# EAGLE design Adafruit 2.9in eInk Display (EAGLE 9.5.0)
COMPANY: ADAFRUIT INDUSTRIES; DRAWN: K. TOWNSEND; REV: A
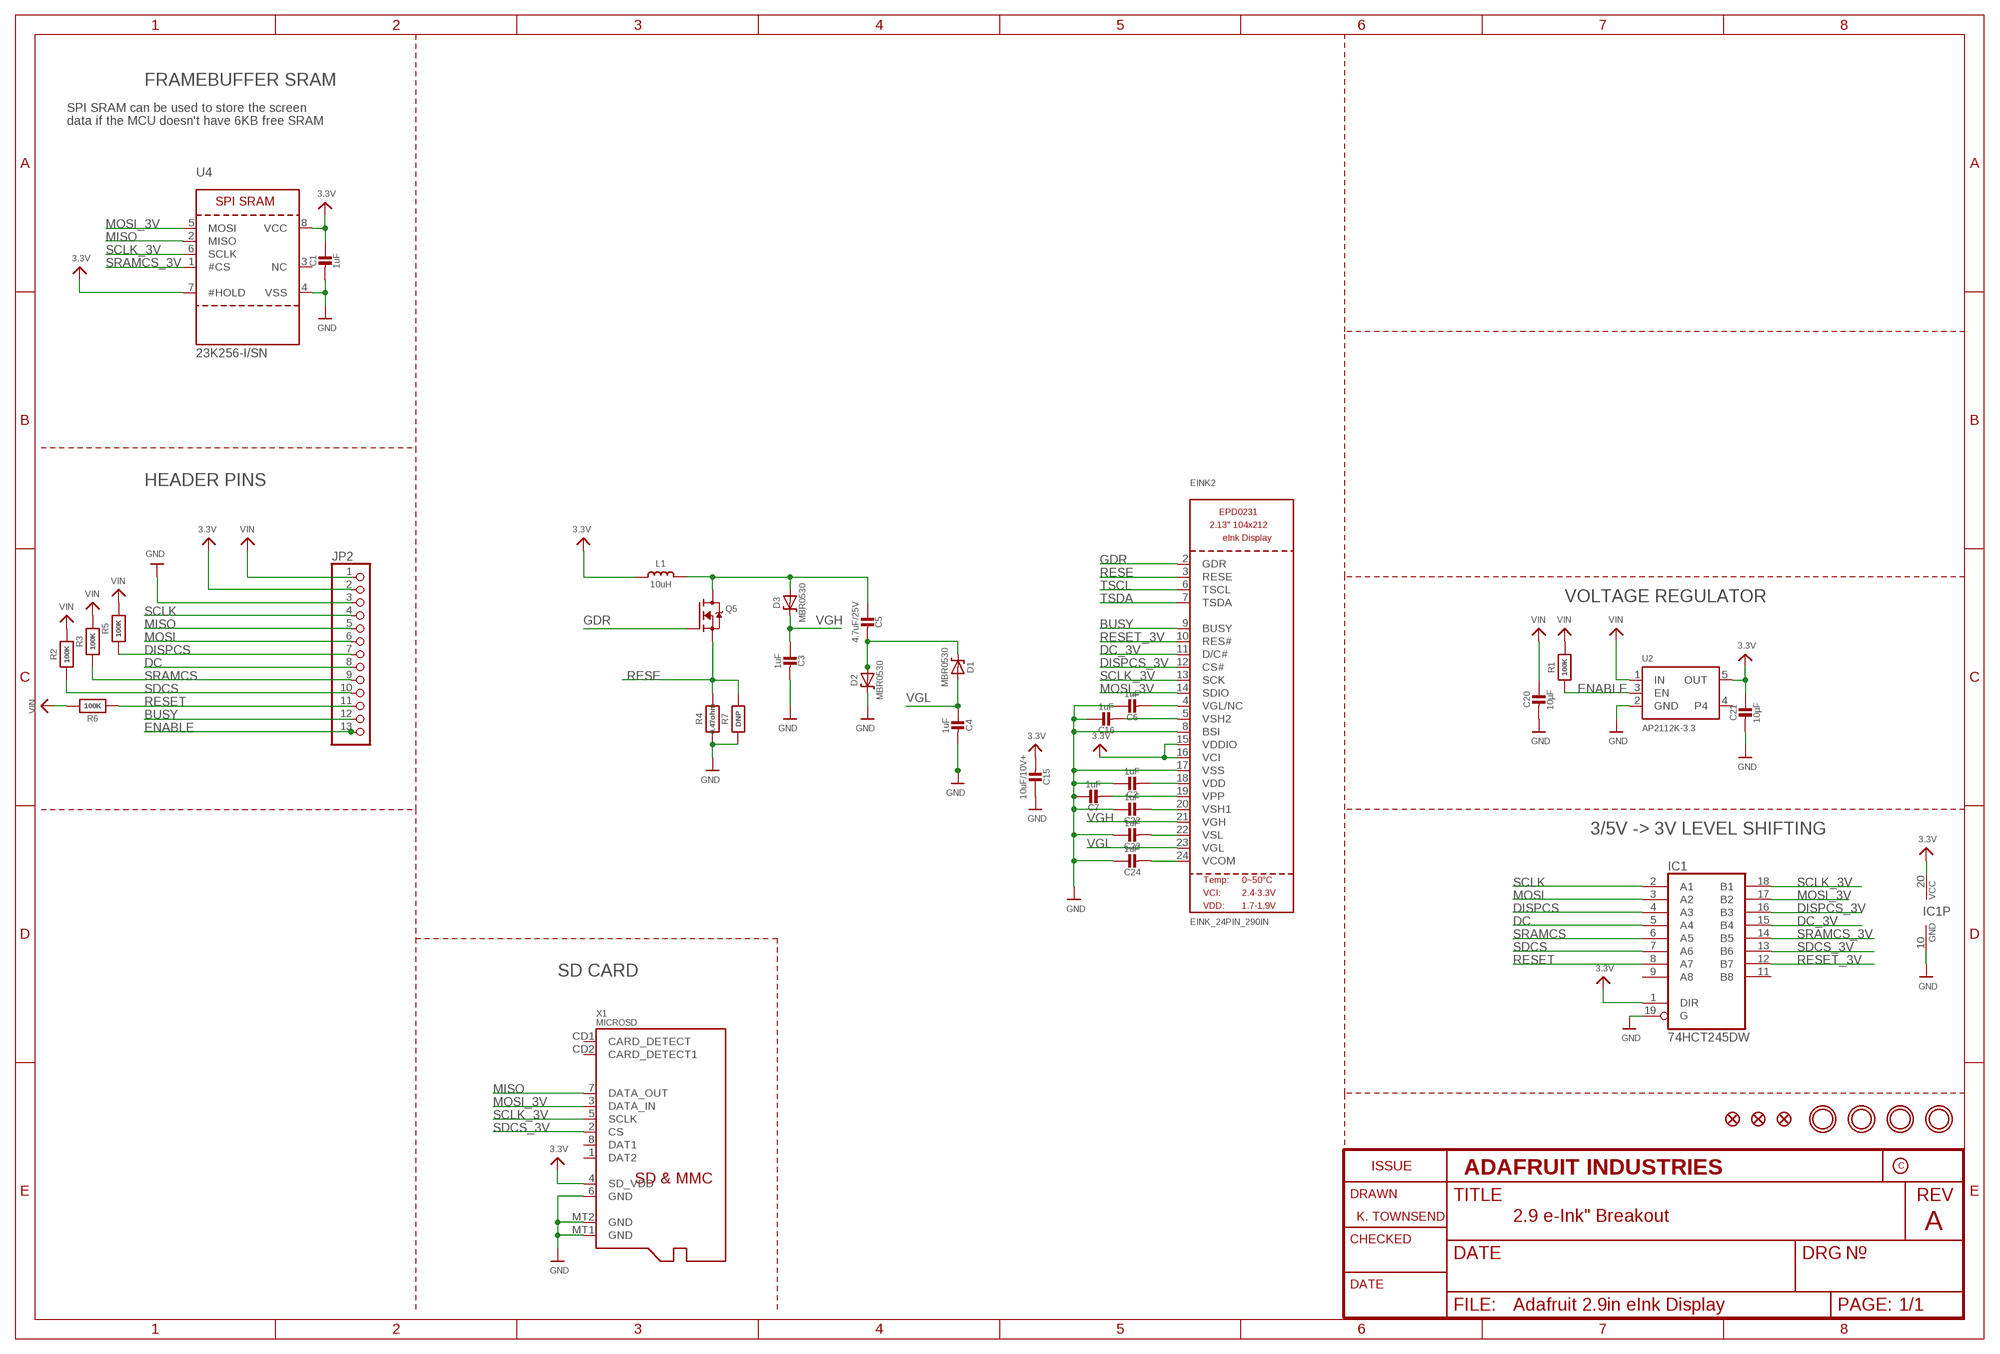
[diagram p0: schematic, sheet 1]

## Parts
C1  1uF  CAP_CERAMIC0805_10MGAP  [0805_10MGAP]
C2  1uF  CAP_CERAMIC0805-NOOUTLINE  [0805-NO]
C3  1uF  CAP_CERAMIC0805-NOOUTLINE  [0805-NO]
C4  1uF  CAP_CERAMIC0805-NOOUTLINE  [0805-NO]
C5  4.7uF/25V  CAP_CERAMIC0805-NOOUTLINE  [0805-NO]
C6  1uF  CAP_CERAMIC0805-NOOUTLINE  [0805-NO]
C7  1uF  CAP_CERAMIC0805-NOOUTLINE  [0805-NO]
C15  10uF/10V+  CAP_CERAMIC0805-NOOUTLINE  [0805-NO]
C16  1uF  CAP_CERAMIC0805-NOOUTLINE  [0805-NO]
C20  10µF  CAP_CERAMIC0805-NOOUTLINE  [0805-NO]
C21  10µF  CAP_CERAMIC0805-NOOUTLINE  [0805-NO]
C22  1uF  CAP_CERAMIC0805-NOOUTLINE  [0805-NO]
C23  1uF  CAP_CERAMIC0805-NOOUTLINE  [0805-NO]
C24  1uF  CAP_CERAMIC0805-NOOUTLINE  [0805-NO]
D1  MBR0530  DIODE-SCHOTTKYSOD-123  [SOD-123]
D2  MBR0530  DIODE-SCHOTTKYSOD-123  [SOD-123]
D3  MBR0530  DIODE-SCHOTTKYSOD-123  [SOD-123]
EINK2  EINK_24PIN_290IN  [EINK_290IN]
FID1  FIDUCIAL_1MM  [FIDUCIAL_1MM]
FID2  FIDUCIAL_1MM  [FIDUCIAL_1MM]
FID3  FIDUCIAL_1MM  [FIDUCIAL_1MM]
IC1  74HCT245DW  [SO20W]
JP2  HEADER-1X13  [1X13_ROUND_70]
L1  10uH  INDUCTORNR401  [INDUCTOR_4X4MM_NR401]
Q5  IRLML0100  IRLML2060TRPBF  [SOT23-3]
R1  100K  RESISTOR0805_NOOUTLINE  [0805-NO]
R2  100K  RESISTOR0805_NOOUTLINE  [0805-NO]
R3  100K  RESISTOR0805_NOOUTLINE  [0805-NO]
R4  0.47ohm  RESISTOR0805_10MGAP  [0805_10MGAP]
R5  100K  RESISTOR0805_NOOUTLINE  [0805-NO]
R6  100K  RESISTOR0805_NOOUTLINE  [0805-NO]
R7  DNP  RESISTOR0805_10MGAP  [0805_10MGAP]
U2  AP2112K-3.3  VREG_SOT23-5  [SOT23-5]
U4  23K256-I/SN  SRAM_SPI_SOIC8  [SOIC8_150MIL]
U$3  MOUNTINGHOLE2.5  [MOUNTINGHOLE_2.5_PLATED]
U$4  MOUNTINGHOLE2.5  [MOUNTINGHOLE_2.5_PLATED]
U$5  MOUNTINGHOLE2.5  [MOUNTINGHOLE_2.5_PLATED]
U$6  MOUNTINGHOLE2.5  [MOUNTINGHOLE_2.5_PLATED]
X1  MICROSD  [MICROSD]

## Nets
3.3V: C1.1 C15.2 C21.1 EINK2.15(VDDIO) EINK2.16(VCI) IC1.1(DIR) IC1.20(VCC) JP2.2 L1.P$2 U2.5(OUT) U4.7(#HOLD) U4.8(VCC) X1.4(SD_VDD)
BUSY: EINK2.9(BUSY) JP2.12
DC: IC1.5(A4) JP2.8
DC_3V: EINK2.11(D/C#) IC1.15(B4)
DISPCS: IC1.4(A3) JP2.7 R5.1
DISPCS_3V: EINK2.12(CS#) IC1.16(B3)
ENABLE: JP2.13 R1.1 U2.3(EN)
GDR: EINK2.2(GDR) Q5.1(G)
GND: C1.2 C2.1 C3.2 C4.2 C6.1 C7.1 C15.1 C16.1 C20.2 C21.2 C22.1 C23.1 C24.1 D2.C EINK2.8(BSI) EINK2.17(VSS) IC1.10(GND) IC1.19(G) JP2.3 R4.2 R7.2 U2.2(GND) U4.4(VSS) X1.6(GND) X1.MT1(GND) X1.MT2(GND)
MISO: JP2.5 U4.2(MISO) X1.7(DATA_OUT)
MOSI: IC1.3(A2) JP2.6
MOSI_3V: EINK2.14(SDIO) IC1.17(B2) U4.5(MOSI) X1.3(DATA_IN)
N$1: C7.2 EINK2.19(VPP)
N$2: C5.2 D1.C D2.A
N$3: C5.1 D3.A L1.P$1 Q5.3(D)
N$4: C16.2 EINK2.5(VSH2)
N$5: C2.2 EINK2.18(VDD)
N$6: C22.2 EINK2.20(VSH1)
N$9: C6.2 EINK2.4(VGL/NC)
N$27: C23.2 EINK2.22(VSL)
N$33: C24.2 EINK2.24(VCOM)
RESE: EINK2.3(RESE) Q5.2(S) R4.1 R7.1
RESET: IC1.8(A7) JP2.11 R6.1
RESET_3V: EINK2.10(RES#) IC1.12(B7)
SCLK: IC1.2(A1) JP2.4
SCLK_3V: EINK2.13(SCK) IC1.18(B1) U4.6(SCLK) X1.5(SCLK)
SDCS: IC1.7(A6) JP2.10 R2.1
SDCS_3V: IC1.13(B6) X1.2(CS)
SRAMCS: IC1.6(A5) JP2.9 R3.1
SRAMCS_3V: IC1.14(B5) U4.1(#CS)
TSCL: EINK2.6(TSCL)
TSDA: EINK2.7(TSDA)
VGH: C3.1 D3.C EINK2.21(VGH)
VGL: C4.1 D1.A EINK2.23(VGL)
VIN: C20.1 JP2.1 R1.2 R2.2 R3.2 R5.2 R6.2 U2.1(IN)
Unconnected: IC1.9(A8) IC1.11(B8) U2.4 U4.3(NC) X1.1(DAT2) X1.8(DAT1) X1.CD1(CARD_DETECT) X1.CD2(CARD_DETECT1)

## Notes on the sheet
- FRAMEBUFFER SRAM
- SPI SRAM can be used to store the screen
- data if the MCU doesn't have 6KB free SRAM
- HEADER PINS
- VOLTAGE REGULATOR
- 3/5V -> 3V LEVEL SHIFTING
- SD CARD
- 2.9 e-Ink" Breakout

## Library data of the parts
C1-C7 C15 C16 C20-C24 = microbuilder:CAP_CERAMIC: Ceramic Capacitors For new designs, use the packages preceded by an '_' character since they are more reliable: The following footprints should be used on most boards: _0402 - Standard footprint for regular board layouts _0603 - Standard footprint for regular board layouts _0805 - Standard footprint for regular board layouts _1206 - Standard footprint for regular board layouts For extremely tight-pitch boards where space is at a premium, the following 'micro-pitch' footprints can be used (smaller pads, no silkscreen outline, etc.): _0402MP - Micro-pitch footprint for very dense/compact boards _0603MP - Micro-pitch footprint for very dense/compact boards _0805MP - Micro-pitch footprint for very dense/compact boards _1206MP - Micro-pitch footprint for very dense/compact boards
D1-D3 = microbuilder:DIODE-SCHOTTKY
EINK2 = microbuilder:EINK_24PIN
FID1-FID3 = microbuilder:FIDUCIAL: Fiducial Alignment Points Various fiducial points for machine vision alignment.; BOM: EXCLUDE
IC1 = 74xx-eu:74*245: Octal BUS TRANSCEIVER, 3-state
JP2 = microbuilder:HEADER-1X13
L1 = microbuilder:INDUCTOR: Inductors 0603: 10nH Ceramic Inductor - microwire antenna/RF (Digikey: 712-1434-2-ND) 0805: 560nH Ceramic Inductor - RF (Digikey: 553-1047-1-ND) 270nH Ceramic Inductor - Q = 40@250MHz, +-5%, 1 Ohm DC Resistance (Digikey: 535-10506-2-ND) 1007 (2518 Metric) SMT: 10µH 10% 250mOhm 820mA 1007 Inductor (Digikey: 587-2189-1-ND) 22µH 10% 500mOhm 580mA 1007 Inductor (Digikey: 587-2190-1-ND) 47µH 10% 950mOhm 420mA 1007 Inductor (Digikey: 587-2191-1-ND) 47µH 5% 100mOhm 1A 1008 Inductor (Digikey: 732-1816-1-ND) 5.0x5.0mm (Taiyo Yuden NR5040 Series) 6.8µH 20% 2.3A 64mOhm Inductor (Digikey: 587-2374-2-ND) 5.0x5.0mm (TDK VLC5045 Series) 4.7µH 20% 3.3A 34mOhm Inductor (Digikey: 445-6526-1-ND) 6.8µH 20% 2.7A 46mOhm Inductor (Digikey: 445-6527-1-ND) 6.0x6.0mm (TDK VLC6045 Series) 4.7µH 20% 3.8A 27mOhm Inductor (Digikey: 445-6538-2-ND) 6.8µH 20% 3A 41mOhm Inductor (Digikey: 445-6540-1-ND) 6.2µH 30% 2.2A 45mOhm Inductor (Digikey: SRR5028-6R2YCT-ND) - Not TDK VLC6045 but footprint should match 6.0x6.0mm (TDK SLF6045 Series) 6.8uH 30% 2A 33mOhm Inductor (Digikey: 445-4572-1-ND, Mouser: 810-SLF645T6R8N2R0PF) 6.0x6.0mm (Sumida CDRH5D28 Series) 6.2uH 30% 1.8A 45mOhm Inductor (Digikey: 308-1542-1-ND) Taiyo Yuden NR3015T2R2M - 2.2uH 20% 1.5A (Digikey: 587-1648-2-ND, Mouser: 963-NR3015T2R2M) - Used with TI TPS62172 CoilCraft RFID Transponder Coil - MA5532-AE (For use with AS3935 Lightning Sensor) Taiyo Yuden NRH2412T2R2MNGH - 2.2uH 20% 1AA (Digikey: 587-3443-1-ND) - Used with TI LM3671 Vishay IHLP 1.0uH Molded Inductor - 24mOhm DCR, 5A, +/-20%, -55°C-125°C (Digikey: 541-1319-1-ND)
Q5 = Parts:IRLML2060TRPBF
R1-R7 = microbuilder:RESISTOR: Resistors For new designs, use the packages preceded by an '_' character since they are more reliable: The following footprints should be used on most boards: _0402 - Standard footprint for regular board layouts _0603 - Standard footprint for regular board layouts _0805 - Standard footprint for regular board layouts _1206 - Standard footprint for regular board layouts For extremely tight-pitch boards where space is at a premium, the following 'micro-pitch' footprints can be used (smaller pads, no silkscreen outline, etc.): _0402MP - Micro-pitch footprint for very dense/compact boards _0603MP - Micro-pitch footprint for very dense/compact boards _0805MP - Micro-pitch footprint for very dense/compact boards _1206MP - Micro-pitch footprint for very dense/compact boards
U2 = microbuilder:VREG_SOT23-5: SOT23-5 Fixed Voltage Regulators Part Current Out V Out V In V Dropout θJA (°C/W) TJ (°C) Digikey Part No. ADP121 150mA 3.3V 3.4-5.5V 0.09V @ 150mA -- -- ADP121-AUJZ33R7CT-ND ADP121 150mA 3.0V 3.1-5.5V 0.09V @ 150mA -- -- ADP121-AUJZ30R7CT-ND ADP122 300mA 3.3V 3.4-5.5V 0.085V @ 300mA -- -- ADP122AUJZ-3.3-R7CT-ND ADP1712 300mA 3.3V 3.5-5.5V 0.17V @ 300mA -- -- ADP1712AUJZ-3.3-R7TR-ND AP7311 (Low Cost) 150mA 3.3V 3.5-6V 0.15V @ 150mA -- -- AP7311-33WG-7DICT-ND LD39015M18R 150mA 1.8V 1.9V-5.5V 0.08V @ 100mA -- -- 497-6977-1-ND LP2985A-33DBVR 150mA 3.3V 3.3-16V 0.28V @ 150mA 206 150 296-18479-1-ND MCP1824T-3302E/OT 300mA 3.3V 3.5V-6V 0.2V @ 300mA -- -- MCP1824T-3302E/OTCT-ND MIC5205-2.5YM5 TR 150mA 2.5V 2.7-16V 0.165V @ 150mA -- -- 576-1257-2-ND MIC5205-3.0YM5 TR 150mA 3.0V 3.2V-16V 0.165V @ 150mA -- -- 576-1258-2-ND MIC5205-3.3YM5 TR 150mA 3.3V 3.5V-16V 0.165V @ 150mA -- -- 576-1259-2-ND TPS780330220 150mA 3.3V+2.2V 3.6-5.5V 250mV Max -- -- 296-23332-1-ND TDA3663/N1,135 100mA 3.3V 3.5-45V 0.18V @ 50mA -- -- 568-5343-1-ND Max operating temp can be calculated using θJA, TJ (max junction temperature), and power in watts. Set the "Maximum Ambient Temperature" until it reaches TJ ("Max Junction Temperature"), which is the absolute limit for safe use of the regulator: Heat Sink Temperature Calculator <http://www.daycounter.com/Calculators/Heat-Sink-Temperature-Calculator.phtml> For example, With 12V source into a 3.3V LP2985 and a 30mA load, we are dissipating (12V-3.3V) * 0.03A = 0.261W. With a θJA of 206 °C/W, a TJ of 150°C, and 261mW we can safely use the chip without a heat sink up to 75°C (=147.1°C Junction Temperature).
U4 = microbuilder:SRAM_SPI_SOIC8: SRAM - 8-Pin SPI Interface 23K640-I/SN - 8KB (64Kb), 20MHz, 2.7-3.6V 23K256-I/SN - 32KB (256Kb), 20MHz, 2.7-3.6V 23LC512-I/SN - 64KB (512Kb), 20MHz, 2.7-3.6V
U$3-U$6 = microbuilder:MOUNTINGHOLE: Mounting Hole For #2 screws (0.086"/2.18mm width, 0.094"/2.4mm hole) use 2.5mm; BOM: EXCLUDE
X1 = microbuilder:MICROSD: MicroSD/Transflash Card Holder with SPI pinout 3M: 2908-05WB-MG 4UConnector: 19656 Footprint courtesy: Adafruit Industries

## Board
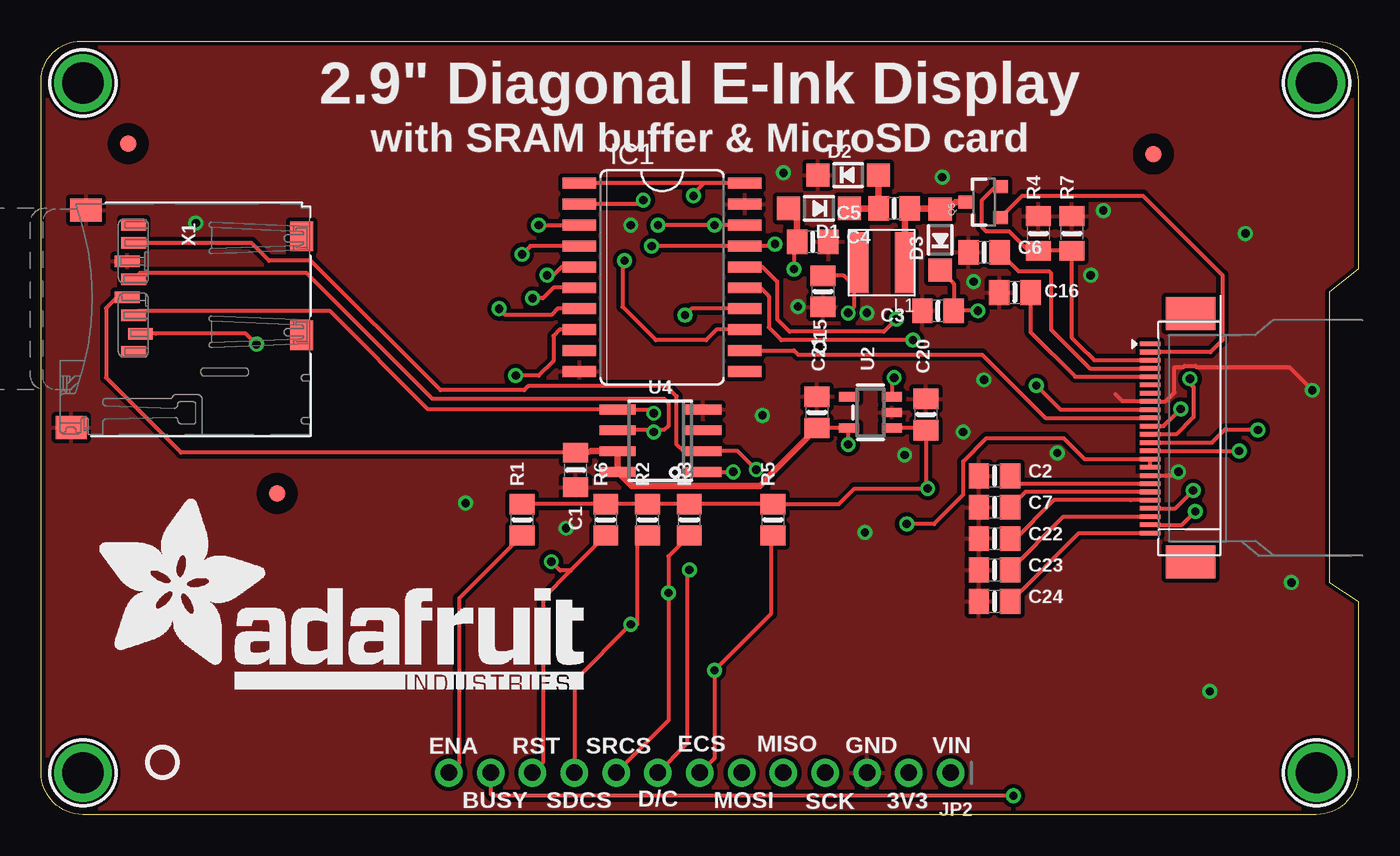
[diagram p1: board, top side]
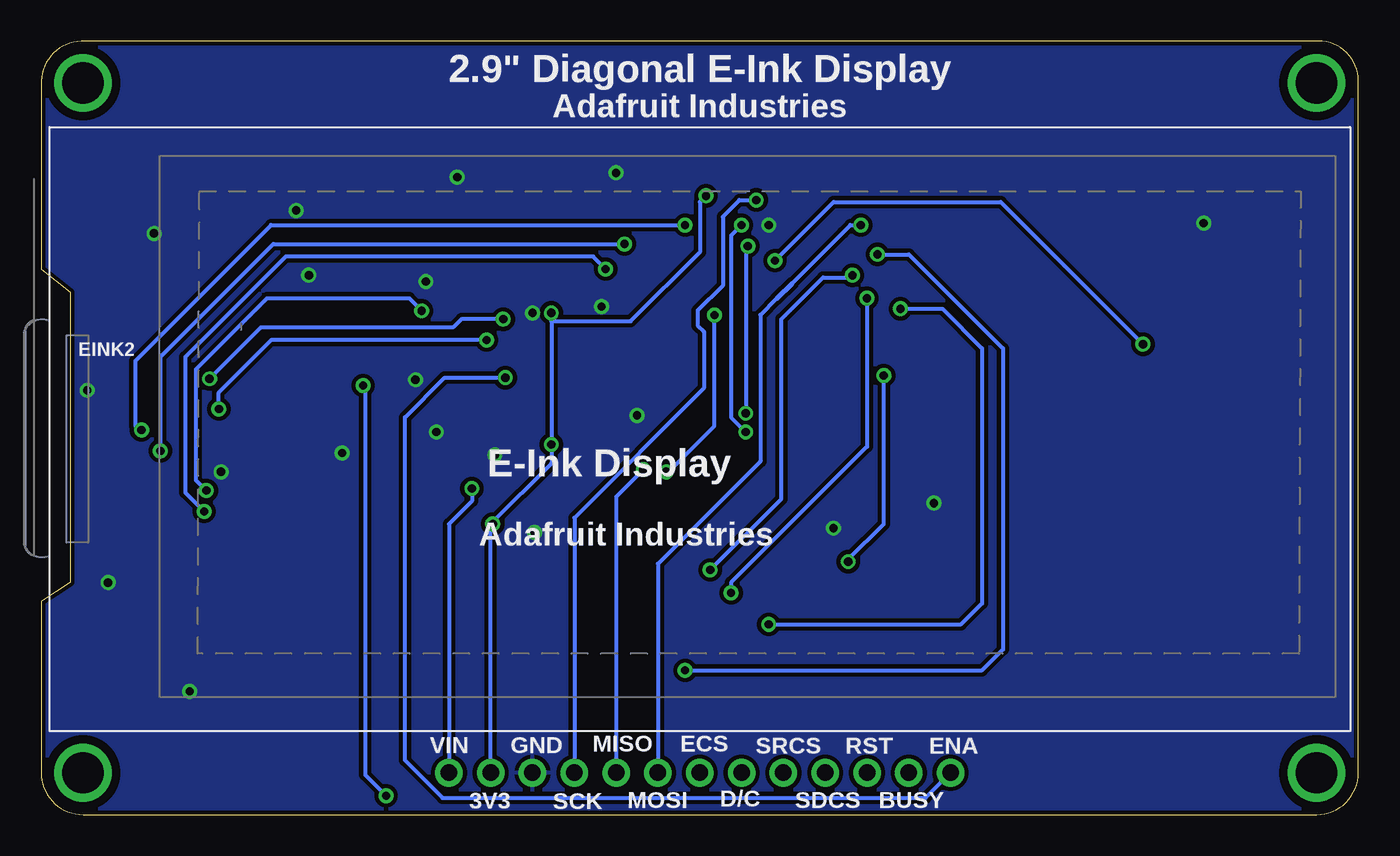
[diagram p2: board, bottom side, seen from below]

Size 80.01 x 46.99 mm. Coordinates in mm from the lower left corner, seen from the top.
Outline: 2.41,46.99 77.34,46.99 arc-90 80.01,44.58 80.01,33.15 78.23,31.75 78.23,14.1 80.01,12.95 80.01,2.54 arc-90 77.47,0 2.53,0 arc-90 0,2.53 0,44.58 arc-90 2.41,46.99
Copper layers (1*16): Top 0.035mm / dielectric 1.5mm / Bottom 0.035mm
Design rules "adafruit *": minimum track width 8mil, minimum drill 15.5mil, track to track 8mil, track to pad 8mil, pad to pad 8mil, via to via 8mil, smd to smd 8mil, copper to edge 10mil, drill to drill 8mil, minimum pad ring 10mil, minimum via ring 8mil, stop-mask expansion 2mil, vias tented up to drill 20mil, thermal gap 10mil

### Footprints (pad centres in the part's own frame; a part is rotated, then mirrored left to right if it is on the bottom)
0805_10MGAP = smd 1.2 x 1.5: 1 -1.05,0; 2 1.05,0
0805-NO = smd 1.24 x 1.5: 1 -0.95,0; 2 0.95,0
SOD-123 = smd 1.4 x 1.4: A 1.85,0; C -1.85,0
EINK_290IN = smd 1.25 x 0.275 bottom: 1 2.51,5.208; 2 2.51,4.708; 3 2.51,4.208; 4 2.51,3.708; 5 2.51,3.208; 6 2.51,2.708; 7 2.51,2.208; 8 2.51,1.708; 9 2.51,1.208; 10 2.51,0.708; 11 2.51,0.208; 12 2.51,-0.292; 13 2.51,-0.792; 14 2.51,-1.292; 15 2.51,-1.792; 16 2.51,-2.292; 17 2.51,-2.792; 18 2.51,-3.292; 19 2.51,-3.792; 20 2.51,-4.292; 21 2.51,-4.792; 22 2.51,-5.292; 23 2.51,-5.792; 24 2.51,-6.292 | smd 3 x 2 bottom: SPRT1 0.05,7.058; SPRT2 0.05,-8.052
FIDUCIAL_1MM = smd 1 x 1: 1 0,0
SO20W = smd 0.66 x 2.032: 1 -5.715,-5.029; 2 -4.445,-5.029; 3 -3.175,-5.029; 4 -1.905,-5.029; 5 -0.635,-5.029; 6 0.635,-5.029; 7 1.905,-5.029; 8 3.175,-5.029; 9 4.445,-5.029; 10 5.715,-5.029; 11 5.715,5.029; 12 4.445,5.029; 13 3.175,5.029; 14 1.905,5.029; 15 0.635,5.029; 16 -0.635,5.029; 17 -1.905,5.029; 18 -3.175,5.029; 19 -4.445,5.029; 20 -5.715,5.029
1X13_ROUND_70 = drill 1 pad 1.676: 1 -15.24,0; 2 -12.7,0; 3 -10.16,0; 4 -7.62,0; 5 -5.08,0; 6 -2.54,0; 7 0,0; 8 2.54,0; 9 5.08,0; 10 7.62,0; 11 10.16,0; 12 12.7,0; 13 15.24,0
INDUCTOR_4X4MM_NR401 = smd 1.2 x 3.7: P$1 -1.4,0; P$2 1.4,0
SOT23-3 = smd 0.8 x 0.9: 1 -0.95,-1; 2 0.95,-1; 3 0,1.1
SOT23-5 = smd 0.55 x 1.2: 1 -0.95,-1.3; 2 0,-1.3; 3 0.95,-1.3; 4 0.95,1.3; 5 -0.95,1.3
SOIC8_150MIL = smd 0.6 x 2.2: 1 -1.905,-2.6; 2 -0.635,-2.6; 3 0.635,-2.6; 4 1.905,-2.6; 5 1.905,2.6; 6 0.635,2.6; 7 -0.635,2.6; 8 -1.905,2.6
MOUNTINGHOLE_2.5_PLATED = drill 2.5 pad 3.2: P$1 0,0
MICROSD = smd 0.7 x 1.5: 1 9,-10.64; 2 7.9,-10.24; 3 6.8,-10.64; 4 5.7,-11.04; 5 4.6,-10.64; 6 3.5,-11.04; 7 2.4,-10.64; 8 1.3,-10.64 | smd 1.8 x 1.4: CD1 2,-0.44; CD2 8,-0.44 | smd 1.4 x 1.9: MT1 0.4,-13.54; MT2 13.6,-14.44

### Placement (x,y rotation side)
C1  32.46,20.93 270 top
C2  57.91,20.57 0 top
C3  54.48,30.61 180 top
C4  46.86,34.8 0 top
C5  51.82,36.83 180 top
C6  57.28,34.16 0 top
C7  57.91,18.67 0 top
C15  47.49,31.79 90 top
C16  59.14,31.71 0 top
C20  53.74,24.31 90 top
C21  47.13,24.44 90 top
C22  57.91,16.76 0 top
C23  57.91,14.86 0 top
C24  57.91,12.95 0 top
D1  47.24,36.83 180 top
D2  49.02,38.86 0 top
D3  54.61,34.92 90 top
EINK2  69.88,23.39 0 bottom
FID1  5.29,40.76 0 top
FID2  14.34,19.51 90 top
FID3  67.56,40.13 0 top
IC1  37.72,32.64 270 top
JP2  40.01,2.54 180 top
L1  51.05,33.53 180 top
Q5  57.28,37.21 90 top
R1  29.21,17.91 90 top
R2  36.83,17.91 90 top
R3  39.37,17.91 90 top
R4  60.58,35.31 90 top
R5  44.45,17.91 90 top
R6  34.29,17.91 90 top
R7  62.61,35.31 90 top
U2  50.37,24.44 90 top
U4  37.61,22.71 90 top
U$3  77.47,2.54 0 top
U$4  2.54,2.54 0 top
U$5  77.47,44.45 0 top
U$6  2.54,44.45 0 top
U$9  [PCBFEAT-REV-040]  7.37,3.17 0 top
U$39  [ADAFRUIT_TEXT_30MM]  3.3,7.62 0 top
X1  16.27,37.12 270 top

### Tracks (layer width: path | path; a pad name or v marks a point on that pad's centre or on a via)
3.3V  (via drill 0.5)
  Top 0.203: C21.1 46.68,23.04
  Top 0.254: 40.26,38.35 IC1.1 | IC1.20 40.26,38.35 | C15.2 48.76,32.74 49.37,32.13 49.37,30.83 v49.02,30.48 | C21.1 U2.5 49.02,23.43 v49.02,22.48 | 40.26,38.35 39.62,37.72 v39.62,37.59 | X1.4 4.59,31.42 3.94,30.77 3.94,26.54 8.49,21.98 C1.1 33.31,21.98 33.4,22.08 | v52.58,17.65 54.23,17.65 56.01,19.44 56.01,21.46 57.42,22.87 62.1,22.87 63.37,21.6 EINK2.15 EINK2.16
  Top 0.406: L1.P$2 49.37,33.24 49.37,32.13 | 46.68,23.04 44.29,20.65 44.29,20.6 43.66,19.97 35.85,19.97 U4.8 U4.7 | U4.7 34.42,22.08 | 34.42,22.08 33.4,22.08 | U4.7 | U4.7 34.42,22.08 | 34.42,22.08
  Bottom 0.254: v49.02,30.48 49.02,29.97 | 49.02,29.97 v49.02,22.48 49.02,21.34 52.7,17.65 | v39.62,37.59 40.01,37.21 40.01,34.16 44.2,29.97 49.02,29.97 | JP2.2 52.7,17.65 | 52.7,17.65 v52.58,17.65
BUSY  (via drill 0.5)
  Top 0.254: v59.05,1.14 27.43,1.14 27.3,1.27 JP2.12 | v60.45,26.07 61.92,24.6 EINK2.9
  Bottom 0.254: v59.05,1.14 60.33,2.41 60.33,25.94 v60.45,26.07
DC  (via drill 0.5)
  Top 0.254: IC1.5 31.62,33.27 31.11,32.77 v30.73,32.77 | v39.37,14.86 39.24,14.73 39.24,4.32 JP2.8
  Bottom 0.254: v39.37,14.86 35.05,19.18 35.05,30.1 32.51,32.64 30.99,32.64 30.86,32.77 v30.73,32.77
DC_3V  (via drill 0.5)
  Top 0.203: v69.22,24.64 68.83,24.26
  Top 0.254: v52.96,28.83 44.96,28.83 44.2,29.59 44.2,31.5 43.69,32 IC1.15 | EINK2.11 68.18,23.6 68.83,24.26
  Bottom 0.254: v52.96,28.83 66.04,28.83 69.26,25.61 69.26,24.68 v69.22,24.64
DISPCS  (via drill 0.5)
  Top 0.254: IC1.4 29.72,34.54 v29.21,34.04 | R5.1 44.32,16.83 44.32,12.19 v40.89,8.76 40.89,3.43 JP2.7
  Bottom 0.254: v29.21,34.04 27.3,34.04 21.59,28.32 21.59,10.03 22.86,8.76 v40.89,8.76
DISPCS_3V  (via drill 0.5)
  Top 0.254: IC1.16 43.81,33.27 44.7,32.38 44.7,30.1 45.47,29.34 51.18,29.34 v51.94,30.1 | EINK2.12 68.95,23.1 70,24.15 70,25.98 69.79,26.19 v69.79,26.48
  Bottom 0.254: v51.94,30.1 54.48,30.1 54.99,29.59 66.67,29.59 v69.79,26.48
ENABLE  (via drill 0.5)
  Top 0.254: U2.3 51.67,26.4 v51.82,26.54 | R1.1 25.4,13.15 25.4,3.17 JP2.13
  Bottom 0.254: JP2.13 26.29,1.02 55.63,1.02 57.91,3.3 57.91,24.13 55.5,26.54 v51.82,26.54 | v51.82,26.54
GDR
  Top 0.254: Q5.1 59.61,37.59 66.93,37.59 71.75,32.77 71.75,28.83 71.03,28.1 EINK2.2
GND  (via drill 0.5)
  Top 0.254: EINK2.17 68.86,20.6 v69.09,20.83 | 65.28,25.53 65.7,25.1 EINK2.8 68.28,25.1 68.83,25.65 68.83,27.18 69.38,27.18 69.46,27.26 70.11,27.26 70.2,27.18 75.82,27.18 v77.22,25.78
  other vias: 45.09,38.99 54.74,38.73 43.81,24.26 52.45,21.84 57.28,26.42 45.97,30.86 56.64,32.38 50.04,17.14 25.78,18.92 9.4,35.94 70.99,7.49 31.88,17.4 35.81,35.81 50.16,30.48 63.75,32.77 73.15,35.31 75.95,14.1 56.01,23.24 61.72,21.97 64.52,36.7
  pour Top (isolate 0.254): 0,46.99 80.01,46.99 80.14,0 0,0
  pour Bottom (isolate 0.254): 0,46.99 80.01,46.99 80.01,0 0,0 0,38.1
MISO  (via drill 0.5)
  Top 0.254: X1.7 12.78,34.72 13.84,33.66 16.38,33.66 24.26,25.78 29.34,25.78 29.59,26.04 37.97,26.04 38.61,25.4 38.61,22.48 39.01,22.08 U4.2 42.31,22.08 v43.43,20.95
  Bottom 0.254: JP2.5 45.09,19.3 v43.43,20.95
MOSI  (via drill 0.5)
  Top 0.254: v30.23,35.81 IC1.3
  Bottom 0.254: 34.42,32.26 30.86,35.81 | 35.31,31.37 36.32,30.35 36.32,21.46 42.55,15.24 JP2.6 | 30.86,35.81 v30.23,35.81 | 30.86,35.81 31.3,35.37 30.86,35.81
  Bottom 0.305: 35.31,31.37 34.42,32.26
MOSI_3V  (via drill 0.5)
  Top 0.203: U4.5 35.81,24.62
  Top 0.254: 35.81,24.62 36.98,24.62 v37.21,24.38 | v44.58,34.67 44.45,34.54 IC1.17 37.72,34.54 v37.08,34.54 | X1.3 5.88,30.58 17.56,30.58 23.52,24.62 U4.5 | v72.77,22.1 EINK2.14 | v37.08,34.54
  Bottom 0.254: v44.58,34.67 65.91,34.67 72.77,27.81 v72.77,22.1 | v37.08,34.54 37.21,34.42 v37.21,24.38
N$1
  Top 0.254: EINK2.19 59.79,19.6 C7.2
N$2
  Top 0.406: D2.A C5.2 D1.C
N$3
  Top 0.406: L1.P$1 52.45,36.52 C5.1 54.55,36.83 D3.A 55.09,36.77 55.52,37.21 Q5.3
N$4
  Top 0.254: C16.2 60.09,29.32 62.81,26.6 66.29,26.6 EINK2.5 | EINK2.5
N$5
  Top 0.254: EINK2.18 59.34,20.1 C2.2
N$6
  Top 0.254: C22.2 59.02,16.6 61.52,19.1 66.17,19.1 EINK2.20 | EINK2.20
N$9
  Top 0.254: C6.2 59.37,33.02 61.21,33.02 61.34,32.89 61.34,29.46 63.7,27.1 EINK2.4
N$27
  Top 0.254: C23.2 62.1,18.1 66.8,18.1 EINK2.22 | EINK2.22
N$33
  Top 0.254: C24.2 58.9,12.95 63.05,17.1 EINK2.24
RESE
  Top 0.254: Q5.2 57.97,38.16 57.15,37.34 57.15,35.69 57.4,35.43 58.8,35.43 59.98,34.26 R4.1 R7.1 | R7.1 62.61,28.96 63.05,28.52 63.97,27.6 EINK2.3 | R7.1
RESET  (via drill 0.5)
  Top 0.254: IC1.8 31.5,29.46 31.11,29.08 31.11,27.56 30.23,26.67 v28.83,26.67 | R6.1 32.16,14.83 | 32.16,14.83 30.48,13.15 30.48,3.17 JP2.11 | 32.16,14.83 31.53,14.83 v30.99,15.37
  Bottom 0.254: v30.99,15.37 30.99,15.49 28.83,17.65 v28.83,26.67
RESET_3V
  Top 0.254: IC1.12 45.72,28.19 45.97,27.94 57.15,27.94 60.99,24.1 EINK2.10
SCLK  (via drill 0.5)
  Top 0.254: IC1.2 36.32,37.08 v36.58,37.34
  Bottom 0.254: v36.58,37.34 37.59,37.34 38.61,36.32 38.61,32.13 40.13,30.61 40.13,29.72 39.75,29.34 39.75,25.91 47.62,18.03 JP2.4
SCLK_3V  (via drill 0.5)
  Top 0.254: 37.08,23.37 37.85,23.37 38.1,23.62 38.1,25.02 37.85,25.27 23.75,25.27 16.12,32.9 6.01,32.9 X1.5 | U4.6 35.03,23.37 37.08,23.37 | v37.47,35.81 IC1.18 v40.89,35.81 | v37.21,23.24 37.08,23.37 | v73.91,23.37 73.89,23.4 71.91,23.4 71.11,22.6 EINK2.13
  Bottom 0.254: v73.91,23.37 74.04,23.37 74.3,23.62 74.3,27.56 | 74.3,27.56 66.04,35.81 v40.89,35.81 | v37.21,23.24 37.34,23.24 37.34,23.37 38.1,24.13 38.1,35.18 v37.47,35.81 | 74.3,27.56
SDCS  (via drill 0.5)
  Top 0.254: IC1.7 31.37,30.73 30.99,30.35 28.19,30.35 v27.81,30.73 | R2.1 36.2,16.32 36.2,11.56 v35.81,11.56 32.38,8.13 JP2.10
  Bottom 0.254: v27.81,30.73 25.27,30.73 22.86,28.32 22.86,12.83 24.13,11.56 v35.81,11.56
SDCS_3V  (via drill 0.5)
  Top 0.254: IC1.13 41.02,29.46 40.39,28.83 37.34,28.83 35.31,30.86 35.31,33.53 v35.43,33.66 | v13.08,28.57 12.43,29.22 6.99,29.22 X1.2 | X1.2
  Bottom 0.254: v35.43,33.66 31.88,37.21 21.72,37.21 v13.08,28.57
SRAMCS  (via drill 0.5)
  Top 0.254: IC1.6 31.11,32 30.48,31.37 v29.84,31.37 | R3.1 38.1,15.69 v38.1,13.46 38.1,5.71 JP2.9
  Bottom 0.254: v29.84,31.37 29.84,22.35 38.1,14.1 v38.1,13.46
SRAMCS_3V  (via drill 0.5)
  Top 0.254: v39.12,30.35 39.5,30.73 IC1.14 | U4.1 40.23,20.83 v42.04,20.83
  Bottom 0.254: 39.12,23.62 41.91,20.83 v42.04,20.83 | 39.12,23.62 | 39.12,23.62 v39.12,30.35
VGH  (via drill 0.5)
  Top 0.254: D3.C 55.43,32.25 C3.1 v56.9,30.61 | EINK2.21 68.89,18.6 v69.98,19.68
  Bottom 0.254: v69.98,19.68 70.61,20.32 70.61,27.05 66.29,31.37 57.66,31.37 v56.9,30.61 | v56.9,30.61
VGL  (via drill 0.5)
  Top 0.254: 45.41,36.82 D1.A | v45.72,33.15 45.72,34.6 C4.1 | v70.1,18.41 69.29,17.6 EINK2.23
  Top 0.406: 45.41,36.82 45.91,36.31 C4.1
  Bottom 0.254: v70.1,18.41 71.25,19.56 71.25,27.81 65.15,33.91 46.48,33.91 v45.72,33.15
VIN  (via drill 0.5)
  Top 0.254: R1.2 R6.2 R2.2 R3.2 R5.2 48.45,18.86 49.4,19.81 v53.85,19.81 53.74,19.92 C20.1 53.74,23.49 U2.1
  Bottom 0.254: v53.85,19.81 53.85,19.05 55.24,17.65 JP2.1

### Text on the board
tPlace: 2.9" Diagonal E-Ink Display | with SRAM buffer & MicroSD card | ENA | RST | SRCS | ECS | MISO | GND | VIN | BUSY | SDCS | D/C | MOSI | SCK | 3V3
bPlace: 2.9" Diagonal E-Ink Display | Adafruit Industries | E-Ink Display | Adafruit Industries | ENA | RST | SRCS | ECS | MISO | GND | VIN | BUSY | SDCS | D/C | MOSI | SCK | 3V3